# EAGLE board PecanPico7 (EAGLE 7.2.0)
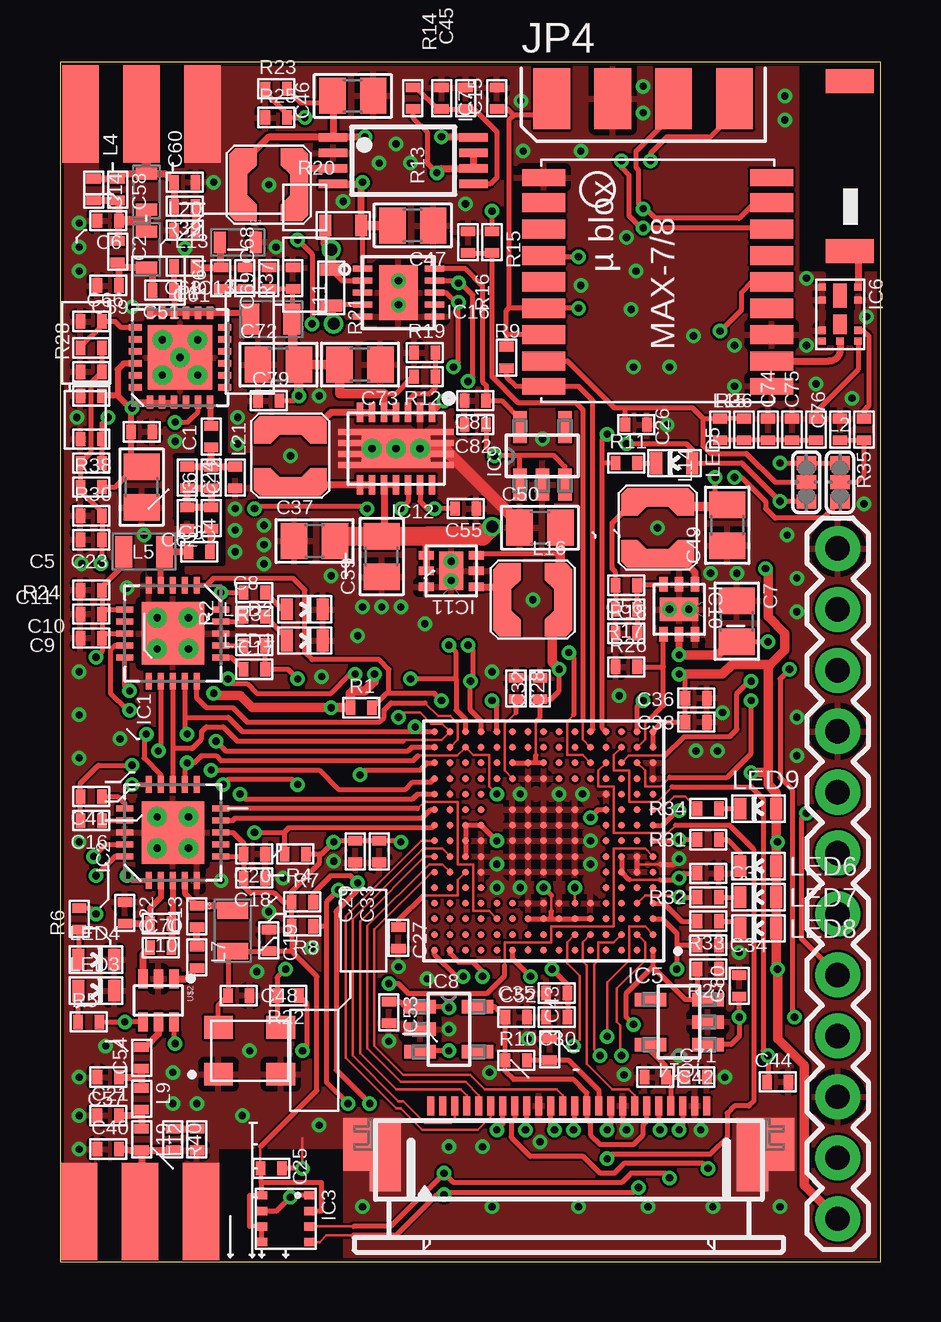
[diagram p5: board, top side]
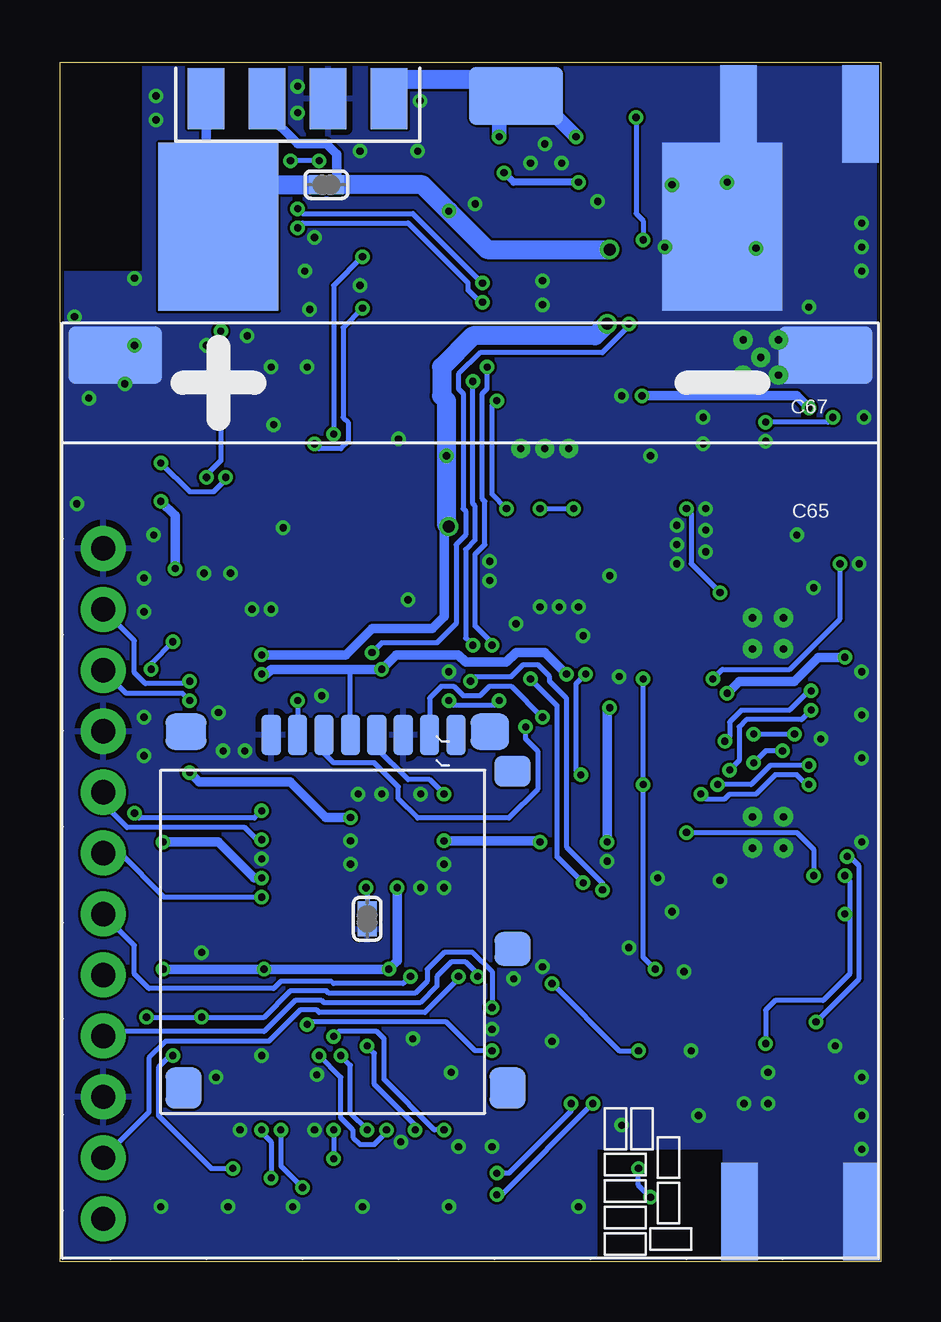
[diagram p6: board, bottom side, seen from below]

Size 34.2 x 50 mm. Coordinates in mm from the lower left corner, seen from the top.
Outline: 0,0 34.2,0 34.2,50 0,50 0,0
Copper layers (1*16): Top 0.035mm / dielectric 1.5mm / Bottom 0.035mm
Design rules "hackvana *": minimum track width 0.1mm, minimum drill 0.3mm, track to track 0.1mm, track to pad 0.1mm, pad to pad 0.1mm, via to via 6mil, smd to smd 0mil, copper to edge 6mil, drill to drill 6mil, minimum pad ring 10mil, minimum via ring 6mil, stop-mask expansion 2mil, vias tented up to drill 100mil, thermal gap 10mil

## Footprints (pad centres in the part's own frame; a part is rotated, then mirrored left to right if it is on the bottom)
LP-443440 = smd 5 x 7: + -10.5,23; - 10.5,23
0402 = smd 0.4 x 0.6: P$1 -0.45,0; P$2 0.45,0
0805 = smd 1.1 x 1.5: 1 -0.85,0; 2 0.85,0
QFN-20 = smd 0.7 x 0.25: 1 -2,1; 2 -2,0.5; 3 -2,0; 4 -2,-0.5; 5 -2,-1; 11 2,-1; 12 2,-0.5; 13 2,0; 14 2,0.5; 15 2,1 | smd 0.25 x 0.7: 6 -1,-2; 7 -0.5,-2; 8 0,-2; 9 0.5,-2; 10 1,-2; 16 1,2; 17 0.5,2; 18 0,2; 19 -0.5,2; 20 -1,2 | smd 2.6 x 2.6: 21 0,0 | drill 0.305: 22 -0.65,0.65; 23 0.65,0.65; 24 0.65,-0.65; 25 -0.65,-0.65
BME280_BME280 = smd 0.5 x 0.35: 1 1.025,0.975; 2 1.025,0.325; 3 1.025,-0.325; 4 1.025,-0.975; 5 -1.025,-0.975; 6 -1.025,-0.325; 7 -1.025,0.325; 8 -1.025,0.975
UBLOX_MAX-6 = smd 1.8 x 0.7: 1_GND 4.95,-4.4; 9_V_RESET 4.95,4.3; 10_GND -4.55,4.3; 18_RESERVED -4.55,-4.4 | smd 1.8 x 0.8: 2_TXD1 4.95,-3.35; 3_RXD1 4.95,-2.25; 4_TIMEPULSE 4.95,-1.15; 5_EXTINT0 4.95,-0.05; 6_V_BCKP 4.95,1.05; 7_VCC_IO 4.95,2.15; 8_VCC 4.95,3.25; 11_RF_IN -4.55,3.25; 12_GND -4.55,2.15; 13_ANTON -4.55,1.05; 14_VCC_RF -4.55,-0.05; 15_RESERVED -4.55,-1.15; 16_SDA2 -4.55,-2.25; 17_SCL2 -4.55,-3.35
UFBGA176 = smd 0.3 x 0.3: A1 -4.55,4.55; A2 -3.9,4.55; A3 -3.25,4.55; A4 -2.6,4.55; A5 -1.95,4.55; A6 -1.3,4.55; A7 -0.65,4.55; A8 0,4.55; A9 0.65,4.55; A10 1.3,4.55; A11 1.95,4.55; A12 2.6,4.55; A13 3.25,4.55; A14 3.9,4.55; A15 4.55,4.55; B1 -4.55,3.9; B2 -3.9,3.9; B3 -3.25,3.9; B4 -2.6,3.9; B5 -1.95,3.9; B6 -1.3,3.9; B7 -0.65,3.9; B8 0,3.9; B9 0.65,3.9; B10 1.3,3.9; B11 1.95,3.9; B12 2.6,3.9; B13 3.25,3.9; B14 3.9,3.9; B15 4.55,3.9; C1 -4.55,3.25; C2 -3.9,3.25; C3 -3.25,3.25; C4 -2.6,3.25; C5 -1.95,3.25; C6 -1.3,3.25; C7 -0.65,3.25; C8 0,3.25; C9 0.65,3.25; C10 1.3,3.25; C11 1.95,3.25; C12 2.6,3.25; C13 3.25,3.25; C14 3.9,3.25; C15 4.55,3.25; D1 -4.55,2.6; D2 -3.9,2.6; D3 -3.25,2.6; D4 -2.6,2.6; D5 -1.95,2.6; D6 -1.3,2.6; D7 -0.65,2.6; D8 0,2.6; D9 0.65,2.6; D10 1.3,2.6; D11 1.95,2.6; D12 2.6,2.6; D13 3.25,2.6; D14 3.9,2.6; D15 4.55,2.6; E1 -4.55,1.95; E2 -3.9,1.95; E3 -3.25,1.95; E4 -2.6,1.95; E12 2.6,1.95; E13 3.25,1.95; E14 3.9,1.95; E15 4.55,1.95; F1 -4.55,1.3; F2 -3.9,1.3; F3 -3.25,1.3; F4 -2.6,1.3; F6 -1.3,1.3; F7 -0.65,1.3; F8 0,1.3; F9 0.65,1.3; F10 1.3,1.3; F12 2.6,1.3; F13 3.25,1.3; F14 3.9,1.3; F15 4.55,1.3; G1 -4.55,0.65; G2 -3.9,0.65; G3 -3.25,0.65; G4 -2.6,0.65; G6 -1.3,0.65; G7 -0.65,0.65; G8 0,0.65; G9 0.65,0.65; G10 1.3,0.65; G12 2.6,0.65; G13 3.25,0.65; G14 3.9,0.65; G15 4.55,0.65; H1 -4.55,0; H2 -3.9,0; H3 -3.25,0; H4 -2.6,0; H6 -1.3,0; H7 -0.65,0; H8 0,0; H9 0.65,0; H10 1.3,0; H12 2.6,0; H13 3.25,0; H14 3.9,0; H15 4.55,0; J1 -4.55,-0.65; J2 -3.9,-0.65; J3 -3.25,-0.65; J4 -2.6,-0.65; J6 -1.3,-0.65; J7 -0.65,-0.65; J8 0,-0.65; J9 0.65,-0.65; J10 1.3,-0.65; J12 2.6,-0.65; J13 3.25,-0.65; J14 3.9,-0.65; J15 4.55,-0.65; K1 -4.55,-1.3; K2 -3.9,-1.3; K3 -3.25,-1.3; K4 -2.6,-1.3; K6 -1.3,-1.3; K7 -0.65,-1.3; K8 0,-1.3; K9 0.65,-1.3; K10 1.3,-1.3; K12 2.6,-1.3; K13 3.25,-1.3; K14 3.9,-1.3; K15 4.55,-1.3; L1 -4.55,-1.95; L2 -3.9,-1.95; L3 -3.25,-1.95; L4 -2.6,-1.95; L12 2.6,-1.95; L13 3.25,-1.95; L14 3.9,-1.95; L15 4.55,-1.95; M1 -4.55,-2.6; M2 -3.9,-2.6; M3 -3.25,-2.6; M4 -2.6,-2.6; M5 -1.95,-2.6; M6 -1.3,-2.6; M7 -0.65,-2.6; M8 0,-2.6; M9 0.65,-2.6; M10 1.3,-2.6; M11 1.95,-2.6; M12 2.6,-2.6; M13 3.25,-2.6; M14 3.9,-2.6; M15 4.55,-2.6; N1 -4.55,-3.25; N2 -3.9,-3.25; N3 -3.25,-3.25; N4 -2.6,-3.25; N5 -1.95,-3.25; N6 -1.3,-3.25; N7 -0.65,-3.25; N8 0,-3.25; N9 0.65,-3.25; N10 1.3,-3.25; N11 1.95,-3.25; N12 2.6,-3.25; N13 3.25,-3.25; N14 3.9,-3.25; N15 4.55,-3.25; P1 -4.55,-3.9; P2 -3.9,-3.9; P3 -3.25,-3.9; P4 -2.6,-3.9; P5 -1.95,-3.9; P6 -1.3,-3.9; P7 -0.65,-3.9; P8 0,-3.9; P9 0.65,-3.9; P10 1.3,-3.9; P11 1.95,-3.9; P12 2.6,-3.9; P13 3.25,-3.9; P14 3.9,-3.9; P15 4.55,-3.9; R1 -4.55,-4.55; R2 -3.9,-4.55; R3 -3.25,-4.55; R4 -2.6,-4.55; R5 -1.95,-4.55; R6 -1.3,-4.55; R7 -0.65,-4.55; R8 0,-4.55; R9 0.65,-4.55; R10 1.3,-4.55; R11 1.95,-4.55; R12 2.6,-4.55; R13 3.25,-4.55; R14 3.9,-4.55; R15 4.55,-4.55
ALM-GP003 = smd 0.3 x 0.3: 1 -1.125,0.75; 2 -1.125,-0.75; 3 -0.595,-0.75; 4 0.675,-0.75; 5 1.125,-0.75; 6 1.125,0; 7 1.125,0.75; 8 0.675,0.75; 9 -0.595,0.75 | smd 1 x 0.55: P1 -0.775,0 | smd 0.8 x 0.55: P2 0.425,0
TSSOP8 = smd 1.2 x 0.35: 1 -2.925,0.975; 2 -2.925,0.325; 3 -2.925,-0.325; 4 -2.925,-0.975; 5 2.925,-0.975; 6 2.925,-0.325; 7 2.925,0.325; 8 2.925,0.975
SOT95P290X145-5N = smd 1.321 x 0.559: 1 -1.194,0.94; 2 -1.194,0; 3 -1.194,-0.94; 4 1.194,-0.94; 5 1.194,0.94
SON65P210X210X80-7N = smd 0.61 x 0.356: 1 -1.041,0.66; 2 -1.041,0; 3 -1.041,-0.66; 4 1.041,-0.66; 5 1.041,0; 6 1.041,0.66 | smd 0.991 x 1.6: 7 0,0
QFN-14 = smd 0.28 x 0.82: 1 -1.5,-1.51; 2 -1,-1.51; 3 -0.5,-1.51; 4 0,-1.51; 5 0.5,-1.51; 6 1,-1.51; 7 1.5,-1.51; 8 1.5,1.51; 9 1,1.51; 10 0.5,1.51; 11 0,1.51; 12 -0.5,1.51; 13 -1,1.51; 14 -1.5,1.51 | drill 0.3: PGND1 -1,0; PGND2 0,0; PGND3 1,0 | smd 2.85 x 1.63: PGND4 0,0 | smd 0.975 x 0.25: PGND5 -1.913,0.69; PGND6 -1.913,0.23; PGND7 -1.913,-0.23; PGND8 -1.913,-0.69; PGND9 1.913,0.69; PGND10 1.913,0.23; PGND11 1.913,-0.23; PGND12 1.913,-0.69
QFN-24 = smd 0.528 x 0.26: 1 -1.864,1.25; 2 -1.864,0.75; 3 -1.864,0.25; 4 -1.864,-0.25; 5 -1.864,-0.75; 6 -1.864,-1.25; 13 1.864,-1.25; 14 1.864,-0.75; 15 1.864,-0.25; 16 1.864,0.25; 17 1.864,0.75; 18 1.864,1.25 | smd 0.26 x 0.528: 7 -1.25,-1.864; 8 -0.75,-1.864; 9 -0.25,-1.864; 10 0.25,-1.864; 11 0.75,-1.864; 12 1.25,-1.864; 19 1.25,1.864; 20 0.75,1.864; 21 0.25,1.864; 22 -0.25,1.864; 23 -0.75,1.864; 24 -1.25,1.864 | smd 2.7 x 2.7: 25 0,0 | drill 0.3: GND 0,0; P$26 -0.735,0.735; P$27 0.735,0.735; P$28 0.735,-0.735; P$29 -0.735,-0.735
DFN300X300X90-11N = smd 0.8 x 0.25: 1 -1.5,1; 2 -1.5,0.5; 3 -1.5,0; 4 -1.5,-0.5; 5 -1.5,-1; 6 1.5,-1; 7 1.5,-0.5; 8 1.5,0; 9 1.5,0.5; 10 1.5,1 | smd 1.6 x 2.3: 11 0,0
SMA-EDGE = smd 1.524 x 4.064: GND@0 0,0; GND@1 5.08,0; SIG 2.54,0 | smd 1.524 x 4.064 bottom: GND@2 0,0; GND@3 5.08,0
LUXEON-PAD = smd 3.9 x 2.4: P$1 0,0
1X12 = drill 1.016 pad 1.88: 1 0,0; 2 2.54,0; 3 5.08,0; 4 7.62,0; 5 10.16,0; 6 12.7,0; 7 15.24,0; 8 17.78,0; 9 20.32,0; 10 22.86,0; 11 25.4,0; 12 27.94,0
2X4_2 = smd 1.524 x 2.54: 1 -3.81,-0.508; 3 -1.27,-0.508; 5 1.27,-0.508; 7 3.81,-0.508 | smd 1.524 x 2.54 bottom: 2 -3.81,-0.508; 4 -1.27,-0.508; 6 1.27,-0.508; 8 3.81,-0.508
0603@1 = smd 0.5 x 0.9: P$1 -0.75,0; P$2 0.75,0
0805@1 = smd 0.7 x 1.3: P$1 -0.85,0; P$2 0.85,0
LPS3015 = smd 0.762 x 2.54: 1_1 -1.27,0; 2_1 1.27,0 | smd 0.889 x 0.254: 1_2 -0.953,-1.397; 1_3 -0.953,1.397; 2_2 0.953,-1.397; 2_3 0.953,1.397 | smd 0.381 x 0.445: 1_4 -0.699,-1.048; 1_5 -0.699,1.048; 2_4 0.699,-1.048; 2_5 0.699,1.048 | smd 0.359 x 0.359 rotated 45: 1_6 -1.398,-1.271; 1_7 -1.398,1.271 | smd 0.538 x 0.538 rotated 45: 1_8 -0.889,-0.823; 1_9 -0.889,0.823 | smd 0.359 x 0.359 rotated 225: 2_6 1.398,-1.271; 2_7 1.398,1.271 | smd 0.538 x 0.538 rotated 225: 2_8 0.889,-0.823; 2_9 0.889,0.823
LED-0603 = smd 0.9 x 0.5: A 0,-0.75; C 0,0.75
0603 = smd 0.5 x 0.9: P$1 -0.75,0; P$2 0.75,0
SJ_2 = smd 0.584 x 0.8: 1 -0.8,0; 2 0,0; 3 0.8,0
SJ = smd 0.584 x 0.8: 1 -0.432,0; 2 0.432,0
MICRO_SD_CONNECTOR = smd 0.8 x 1.7: 1 4.4,15.57; 2 5.5,15.57; 3 6.6,15.57; 4 7.7,15.57; 5 8.8,15.57; 6 9.9,15.57; 7 11,15.57; 8 12.1,15.57 | smd 1.5 x 1.7: P$1 0.75,0.85; P$6 14.25,0.85 | smd 1.7 x 1.5: P$2 0.85,15.7 | smd 1.5 x 1.4: P$3 14.46,6.65 | smd 1.5 x 1.3: P$4 14.46,14.05 | smd 1.6 x 1.5: P$5 13.51,15.7
SC-70 = smd 0.4 x 0.8: 1 -0.65,-0.9; 2 0,-0.9; 3 0.65,-0.9; 4 0.65,0.9; 5 0,0.9; 6 -0.65,0.9
TCXO_3.2X2.5 = smd 1.2 x 0.95: 1 -1.3,-0.975; 2 1.3,-0.975; 3 1.3,0.975; 4 -1.3,0.975
JTI_ANTENNA-1575AT43A40 = smd 1 x 2: FEED -3.175,0; NC 3.925,0
52745-2490 = smd 0.3 x 0.8: 1 -5.75,2.5; 2 -5.25,2.5; 3 -4.75,2.5; 4 -4.25,2.5; 5 -3.75,2.5; 6 -3.25,2.5; 7 -2.75,2.5; 8 -2.25,2.5; 9 -1.75,2.5; 10 -1.25,2.5; 11 -0.75,2.5; 12 -0.25,2.5; 13 0.25,2.5; 14 0.75,2.5; 15 1.25,2.5; 16 1.75,2.5; 17 2.25,2.5; 18 2.75,2.5; 19 3.25,2.5; 20 3.75,2.5; 21 4.25,2.5; 22 4.75,2.5; 23 5.25,2.5; 24 5.75,2.5 | smd 2.4 x 2.2: P$1 -8.2,0.9; P$2 8.2,0.9 | smd 1.3 x 0.85: P$3 7.65,-0.625; P$4 -7.65,-0.625

## Placement (x,y rotation side)
BATT  LP-443440  [LP-443440]  17.1,20.15 0 bottom
C1  470pF  [0402]  6.3,34.4 90 top
C2  2.2pF  [0402]  2.4,42.1 270 top
C3  470pF  [0402]  5.8,29.6 180 top
C4  47pF  [0402]  5.3,31 90 top
C5  2.2uF  [0402]  1.3,34.3 0 top
C6  47pF  [0402]  2,43.4 0 top
C7  10uF  [0805]  28.2,26.7 270 top
C8  100pF  [0402]  8.1,25.7 0 top
C9  100pF  [0402]  1.3,26 0 top
C10  100nF  [0402]  1.3,27 0 top
C11  2.2uF  [0402]  1.3,28 0 top
C12  47pF  [0402]  7.3,32.7 90 top
C13  470pF  [0402]  5.7,14.4 90 top
C14  2.7pF  [0402]  1.4,44.7 270 top
C15  100nF  [0402]  18.2,48.5 90 top
C16  100pF  [0402]  1.3,18.4 180 top
C17  100pF  [0402]  8.1,24.7 0 top
C18  100pF  [0402]  8.1,16 180 top
C19  100nF  [0402]  8.7,13.4 270 top
C20  2.2uF  [0402]  8.1,17 180 top
C21  18pF  [0402]  2,6.1 0 top
C22  470pF  [0402]  2.7,14.55 270 top
C23  1uF  [0402]  1.3,30.1 0 top
C24  10pF  [0402]  5.3,32.7 270 top
C25  100nF  [0402]  8.8,3.9 180 top
C26  100nF  [0402]  24,34.9 180 top
C27  2.2uF  [0402]  14.1,13.5 270 top
C28  2.2uF  [0402]  19,23.9 90 top
C29  2.2uF  [0402]  12.3,17.1 270 top
C30  2.2uF  [0402]  20.7,10.2 180 top
C31  100nF  [0402]  27,16.2 0 top
C32  100nF  [0402]  20,23.9 90 top
C33  100nF  [0402]  13.3,17.1 270 top
C34  100nF  [0402]  27,13.2 0 top
C35  100nF  [0402]  20.7,11.2 180 top
C36  2.2uF  [0402]  26.5,23.5 0 top
C37  22uF  [0805]  10.6,30.05 0 top
C38  100nF  [0402]  26.5,22.5 0 top
C39  10uF  [0805]  13.4,29.4 90 top
C40  12pF  [0402]  2,4.7 0 top
C41  100pF  [0402]  1.3,19.4 180 top
C42  100pF  [0402]  24.8,7.7 180 top
C43  100nF  [0402]  20.4,8.85 90 top
C44  15pF  [0402]  29.9,7.5 0 top
C45  1nF  [0402]  16.9,48.5 270 top
C46  22uF  [0805]  12.2,48.6 180 top
C47  10uF  [0805]  14.7,43.2 180 top
C48  100nF  [0402]  7.45,11.1 0 top
C49  10uF  [0805]  27.8,30.7 90 top
C50  10uF  [0805]  20,30.6 0 top
C51  470pF  [0402]  4.3,40.5 180 top
C52  100nF  [0402]  19,10.2 0 top
C53  100nF  [0402]  13.7,10.4 270 top
C54  470pF  [0402]  3.4,8.5 90 top
C55  100nF  [0402]  16.9,31.4 180 top
C56  22pF  [0402]  23.6,28.2 180 top
C57  12pF  [0402]  2,7.7 180 top
C58  3.3pF  [0402]  2.4,44.7 270 top
C59  33pF  [0402]  2,40.7 0 top
C60  30pF  [0402]  5.2,45 180 top
C61  220pF  [0402]  3.4,34.6 180 top
C62  10uF  [0805]  3.4,32.3 90 top
C63  8.2pF  [0402]  5.2,41.5 180 top
C64  8.2pF  [0402]  6.7,41 90 top
C65  1uF  [0402]  1.3,36.1 0 top
C66  2.2uF  [0402]  1.3,39.2 0 top
C67  1uF  [0402]  1.3,37.1 0 top
C68  1nF  [0402]  9.7,41 270 top
C69  2.2uF  [0402]  8.7,41 270 top
C70  470pF  [0402]  4.2,13.1 0 top
C71  100nF  [0402]  26.5,7.7 0 top
C72  22uF  [0805]  9.1,37.4 0 top
C73  22uF  [0805]  12.5,37.4 180 top
C74  100nF  [0402]  29.5,34.7 270 top
C75  47pF  [0402]  30.5,34.7 270 top
C76  330pF  [0402]  32.5,34.7 270 top
C79  100nF  [0402]  8.7,35.9 0 top
C80  100nF  [0402]  28.3,11.5 90 top
C81  100nF  [0402]  17.3,35.9 180 top
C82  100nF  [0402]  17.3,34.9 180 top
IC1  Si4060-B1B-FM  [QFN-20]  4.7,26.2 270 top
IC2  Si4060-B1B-FM  [QFN-20]  4.7,17.9 90 top
IC3  BME280_BME280  [BME280_BME280]  9.4,1.8 0 top
IC4  uBlox MAX7/8  [UBLOX_MAX-6]  25.1,40.8 180 top
IC5  STM32F429IIH6  [UFBGA176]  20.15,17.55 180 top
IC6  ALM-GP003  [ALM-GP003]  32.5,39.5 270 top
IC7  SPV1040  [TSSOP8]  14.3,45.9 0 top
IC8  TI TC1185-1.8VCT713  [SOT95P290X145-5N]  16.2,9.7 0 top
IC9  TPS78227DDCR  [SOT95P290X145-5N]  20.1,33.6 90 top
IC10  TPS62260DRVT  [SON65P210X210X80-7N]  25.8,27.2 270 top
IC11  TPS62261DRVT  [SON65P210X210X80-7N]  16.3,28.8 180 top
IC12  TPS63021  [QFN-14]  14,33.9 180 top
IC13  RF6886  [QFN-24]  5,37.7 90 top
IC14  TPS78227DDCR  [SOT95P290X145-5N]  25.8,10 180 top
IC16  PAC1720-1-AIA-TR  [DFN300X300X90-11N]  14.1,40.4 0 top
J$1  SMA_EDGE  [SMA-EDGE]  0.85,47.85 0 top
J$2  SMA_EDGE  [SMA-EDGE]  0.8,2.1 0 top
JP2  [LUXEON-PAD]  15.2,48.6 180 bottom
JP3  [1X12]  32.4,1.8 90 top
JP4  [2X4_2]  24.3,49 0 top
JP5  [LUXEON-PAD]  2.3,37.8 0 bottom
JP6  [LUXEON-PAD]  31.9,37.8 180 bottom
L1  59nH  [0603@1]  3.6,42.2 90 top
L2  1.8nH  [0402]  31.5,34.7 270 top
L3  56nH  [0402]  6.3,31 90 top
L4  51nH  [0603@1]  3.6,44.6 90 top
L5  470nH  [0805@1]  3.5,29.6 180 top
L6  30nH  [0402]  6.3,32.7 90 top
L7  56nH  [0402]  5.7,12.7 270 top
L8  470nH  [0805@1]  7.2,13.8 270 top
L9  22nH  [0402]  3.4,6.8 270 top
L10  56nH  [0402]  4.2,14.1 180 top
L11  470nH  [0805@1]  8.8,39.3 0 top
L12  2.2uH  [0402]  5.7,5.1 90 top
L13  LPS3015-103MRB  [LPS3015]  8.7,44.9 0 top
L14  LPS3015-222MRB  [LPS3015]  24.9,30.6 270 top
L15  22nH  [0402]  27.5,34.7 90 top
L16  LPS3015-222MRB  [LPS3015]  19.7,27.6 180 top
L17  30nH  [0603@1]  7.4,42.5 180 top
L19  22nH  [0402]  3.4,5.1 270 top
L20  2.2uH  [0402]  5.2,43 0 top
L21  LPS3015-222MRB  [LPS3015]  9.6,33.6 270 top
LED1  blue  [LED-0603]  10.2,25.9 270 top
LED2  blue  [LED-0603]  10.2,27.2 270 top
LED3  yellow  [LED-0603]  1.5,11.3 270 top
LED4  blue  [LED-0603]  1.5,12.6 270 top
LED5  red  [LED-0603]  25.6,33.3 90 top
LED6  red  [LED-0603]  29.1,16.5 90 top
LED7  yellow  [LED-0603]  29.1,15.2 90 top
LED8  green  [LED-0603]  29.1,13.9 90 top
LED9  green  [LED-0603]  29.1,18.9 90 top
R1  110k  [0402]  12.55,23.1 0 top
R2  1k  [0402]  8.1,26.9 180 top
R3  330R  [0402]  8.1,27.9 180 top
R4  110k  [0402]  9.8,17 180 top
R5  1k  [0402]  1.2,10 0 top
R6  330R  [0402]  0.8,14.3 90 top
R7  10k  [0402]  10.1,15 180 top
R8  10k  [0402]  10.1,14 180 top
R9  100k  [0402]  18.6,37.7 270 top
R10  DIODE  [0402]  19,8.4 0 top
R11  1k  [0402]  23.6,33.3 0 top
R12  0R  [0402]  15.2,36.9 180 top
R13  22k  [0402]  14.7,48.5 270 top
R14  10k  [0402]  15.9,48.5 270 top
R15  22k  [0402]  18,42.5 90 top
R16  10k  [0402]  17,42.5 270 top
R17  511k  [0402]  23.6,27.2 180 top
R18  110k  [0402]  23.6,26.2 0 top
R19  [0402]  15.2,37.9 0 top
R20  0.1R  [0603]  11.8,43.2 180 top
R21  0.1R  [0603]  11.3,40.6 270 top
R22  10k  [0402]  9.5,11.1 180 top
R23  1k  [0402]  9,48.9 0 top
R24  220R  [0402]  1.3,33.3 0 top
R25  1k  [0402]  9,47.7 0 top
R26  10k  [0402]  23.6,24.8 0 top
R27  110k  [0402]  27,12.2 180 top
R28  220R  [0402]  1.3,38.1 0 top
R30  10k  [0402]  1.3,31.1 0 top
R31  1k  [0402]  27,17.6 180 top
R32  1k  [0402]  27,15.2 180 top
R33  1k  [0402]  27,14.2 180 top
R34  1k  [0402]  27,18.9 180 top
R35  4.7k  [0402]  33.5,34.7 270 top
R36  10k  [0402]  28.5,34.7 90 top
R37  51R  [0402]  7.7,41 270 top
R38  1k  [0402]  1.3,32.3 0 top
R39  22k  [0402]  5.2,44 180 top
R40  22k  [0402]  4.7,5.1 270 top
SJ1  [SJ_2]  32.5,32.5 270 top
SJ2  [SJ_2]  31.1,32.5 270 top
SJ3  [SJ]  23.1,44.9 0 bottom
SJ7  [SJ]  21.4,14.3 270 bottom
U$1  MICROSD_SPI_MODE  [MICRO_SD_CONNECTOR]  29.8,6.4 0 bottom
U$2  AS213-92LF  [SC-70]  4.1,10.9 180 top
U$3  TXC_7Z7Q  [TCXO_3.2X2.5]  7.9,8.8 0 top
U$4  JTI_ANTENNA-1575AT43A40  [JTI_ANTENNA-1575AT43A40]  32.9,45.3 90 top
X1  52745-2490  [52745-2490]  21.2,4 0 top

## Tracks (layer width: path | path; a pad name or v marks a point on that pad's centre or on a via)
BATTERY
  Bottom 0.2: 23.7,44.9 SJ3.1
  Bottom 0.4: 27.6,44.9 27.6,44 | 27.6,44 BATT.+ | JP4.8 28.11,44 27.6,44
  Bottom 0.8: 27.6,44.9 23.7,44.9
BOOT0  (via drill 0.3)
  Top 0.1: IC5.D6 v21.45,15.6
  Bottom 0.2: SJ7.1 21.4,15.55 v21.45,15.6
CAM_D2
  Top 0.1: X1.6 17.95,6.05 17.4,5.5 15.1,5.5 14.2,6.4 14,6.4 11.9,8.5 11.9,14.4 15.05,17.55 IC5.H15
CAM_D3
  Top 0.1: X1.4 16.95,6.95 16.7,7.2 14,7.2 12.5,8.7 12.5,14.2 15.2,16.9 IC5.G15
CAM_D4
  Top 0.1: IC5.G14 15.93,17.23 15.12,17.23 12.2,14.3 12.2,8.6 14.1,6.7 14.3,6.7 15.2,5.8 16.3,5.8 16.45,5.95 X1.3
CAM_D5
  Top 0.1: IC5.F14 15.93,16.57 15.38,16.57 12.8,14 12.8,8.9 14.2,7.5 16.9,7.5 17.45,6.95 X1.5
CAM_D6  (via drill 0.3)
  Top 0.1: IC5.B1 24.38,13.97 23.73,13.97 23.73,12.57 22.8,11.65 v22.8,9.4
  Top 0.2: v18.2,5.5 18.45,5.75 X1.7
  Bottom 0.2: v18.2,5.5 18.6,5.5 20.7,7.6 20.7,9.3 21,9.6 22.6,9.6 v22.8,9.4
CAM_D7  (via drill 0.3)
  Top 0.1: IC5.B6 21.12,13.32 21.12,12.45 21.65,11.93 21.65,9.25 v21.4,9
  Top 0.2: X1.9 19.45,5.55 v19.4,5.5
  Bottom 0.2: v19.4,5.5 19.4,5.7 21.1,7.4 21.1,8.7 v21.4,9
CAM_D8  (via drill 0.3)
  Top 0.1: IC5.B2 24.38,13.32 24.38,12.57 23.2,11.4 23.2,10 23.35,9.85 23.35,8.65 v23.4,8.6
  Top 0.2: v20.6,5.5 20.45,5.65 X1.11
  Bottom 0.2: v20.6,5.5 20.6,5.4 21.1,4.9 21.7,4.9 22,5.2 22,5.5 22.5,6 22.5,7.7 v23.4,8.6
CAM_D9  (via drill 0.3)
  Top 0.1: IC5.B3 23.07,13.32 22.43,13.32 22.43,12.57 22.25,12.4 22.25,8.85 v22.5,8.6
  Top 0.2: v21.4,5.5 21.45,5.55 X1.13
  Bottom 0.2: v21.4,5.5 22.1,6.2 22.1,8.2 v22.5,8.6
CAM_EN  (via drill 0.3)
  Top 0.2: IC5.A1 24.7,12.3 | 24.7,12.3 26.06,10.94 IC14.3 26.55,10.94 R27.P$2 | 24.7,12.3 23.6,11.2 23.6,10.2 v23.9,9.9 | v16.2,8.8 15.01,8.8 IC8.3
  Bottom 0.2: v23.9,9.9 23.8,10 18.1,10 16.9,8.8 v16.2,8.8
CAM_HREF  (via drill 0.3)
  Top 0.1: IC5.N4 22.43,20.48 22.43,19.82 23.07,19.82 23.07,17.88 25.32,17.88 25.65,18.2
  Top 0.2: X1.16 22.95,5.65 v22.8,5.5 | 25.65,18.2 27.9,18.2 28.9,17.2 28.9,6.7 28.7,6.5 28.1,6.5 27.8,6.2 27.8,5.2 27.1,4.5 23,4.5 v22.8,4.3
  Bottom 0.2: v22.8,5.5 v22.8,4.3
CAM_PCLK  (via drill 0.3)
  Top 0.1: IC5.P3 23.07,21.12 23.07,20.48 23.73,20.48 23.73,19.18 24.88,19.18 25.5,19.8
  Top 0.2: X1.8 18.95,5.95 18.8,5.8 18.8,5.2 19.6,4.4 21.8,4.4 22.5,3.7 23.1,3.7 23.5,4.1 26.8,4.1 v27,3.9 | C44.P$1 29.5,7.5 v29.5,8.6 29.3,8.8 29.3,19.3 28.8,19.8 25.5,19.8
  Bottom 0.2: v29.5,8.6 29.6,8.6 30.1,8.1 30.1,6.1 27.9,3.9 v27,3.9
CAM_VCC
  Top 0.2: IC8.5 18.11,10.64 C52.P$1 R10.P$1 18.55,7.95 18.9,7.6 21.4,7.6 21.95,7.05 X1.14 21.95,5.95 22.1,5.8 22.1,5.3 22.5,4.9 23.9,4.9 24.3,5.3 24.3,5.7 24.45,5.85 X1.19
CAM_VCC_ANALOG
  Top 0.2: 25.45,7.7 C71.P$1 | 25.45,7.7 C42.P$1 25.25,8.15 24.61,8.79 IC14.5 | 25.45,7.7 X1.21
CAM_VSYNC
  Top 0.1: IC5.B5 21.77,13.32 21.77,12.53 21.95,12.35 21.95,8.25 23,7.2 23.7,7.2 23.95,6.95 X1.18
CAM_XCLK
  Top 0.1: X1.12 20.95,6.95 20.7,7.2 17.7,7.2 17.1,7.8 14.3,7.8 13.1,9 13.1,13.85 15.5,16.25 IC5.F15
CLOCK  (via drill 0.3)
  Top 0.2: v9.4,12.2 9.05,11.85 R22.P$2 9.05,9.78 U$3.3 | v6.8,19.9 7,20.1 9.7,20.1 v9.9,19.9 | C16.P$2 C41.P$2 0.85,19.95 1.6,20.7 v3,20.7 | v9.9,24.3 9.5,24.7 C17.P$2 C8.P$2
  Bottom 0.2: v9.4,12.2 9.9,12.7 v9.9,19.9 v9.9,24.3 | v3,20.7 4.6,20.7 5.4,19.9 v6.8,19.9
GND  (via drill 0.3)
  Top 0.1: 24.05,16.57 25,16.57 | v10.1,3.9 10.1,5.15
  Top 0.2: IC5.F2 24.05,16.57 IC5.G2 | X1.17 23.45,5.65 v23.6,5.5 | IC1.25 IC1.21 | IC3.7 9.03,2.12 v9.6,2.7 9.68,2.77 IC3.1 | v10.1,3.9 C25.P$1 | 25,16.57 25.57,16.57 v25.8,16.8
  Top 0.5: C50.1 19.15,30.75 16,33.9 IC12.PGND1
  Bottom 0.2: v9.6,2.7 10.1,3.2 v10.1,3.9
  other vias: 22.1,17.55 18.2,16.57 18.2,15.6 19.18,15.6 17.6,4.8 33.6,39.4 0.8,42.3 23.8,39.7 21.7,40.7 23.9,37.3 25.4,37.3 26.4,38.6 30.2,48.6 30.7,28.5 30.7,21.1 21.6,2.3 30.3,30.3 33,36 31.1,38.2 31.1,41 20.8,19.5 22.1,16.57 18,2.3 24.5,2.3 27.2,2.3 14.1,39.9 14.1,40.9 28.1,38.2 28.1,36.5 30.7,22.7 28.3,12.9 23.6,42.7 24,41.3 14.6,45.8 19.2,48.4 13.3,45.8 19.3,46.3 30.2,47.6 31.5,36.6 25.4,27.2 30.7,27.1 19.18,19.5 23.5,7.8 4.8,34.2 0.8,21 0.8,22.8 6.7,15.9 18,24.6 16.2,9.7 9.3,16 0.9,29.1 11.4,16.7 26.2,27.2 2.8,28.1 27.6,22.9 0.7,35.2 0.8,17.5 26.5,21.3 23.3,23.6 27.1,28.7 28.2,28.7 20,5 21.77,19.5 4.7,7.9 4.7,6.6 0.8,4.7 0.8,6.1 0.8,7.7 1.9,9 12.6,2.3 16.2,4.8 30,2.3 33.5,31.6 9,42.3 0.8,41.3 0.8,43.3 6.4,45 11.8,44.2 8.7,14.6 11.3,28.6 16.9,44.1 21.7,46.3 8.5,30.7 8.5,29.1 8.5,29.9 7.3,30.5 7.3,31.4 7.4,35.2 7.4,34.1 9.6,33.6 10.8,36.1 5.2,42.25 8.7,44.9 25.3,34.9 14,46.6 3.5,30.3 20.1,34.3 16.3,28.4 16.3,29.2 27.7,7.7 25.8,8.6 26.7,5.5 13.7,9.2 10.5,13.1 7.9,8.8 19.7,27.6 24.9,30.6 15.2,26.6 12.6,27.3 13.4,27.3 12.4,26.1 8.2,12.1 5.7,6.6 7.6,6.1 10.8,5.7 14.2,27.3 7.3,29.6 10.9,24.4 0.8,24.6 2.5,21.8 14.1,12.3 19.5,9.3 15.3,11.8 17.9,7.9 3,39.8 27.4,21.3 24.3,49 24.3,47.9
  pour Bottom: 0,50 30.7,50 30.7,41.2 34.2,41.2 34.2,0 11.9,0 11.9,4.8 6.5,4.8 6.5,0 0,0
  pour Top: 0,50 1.5,50 1.5,45.5 5.3,45.5 5.3,50 30.7,50 30.7,41.2 31.8,41.2 31.8,38.1 33.2,38.1 33.2,41.2 34.2,41.2 34.2,0 11.9,0 11.9,4.8 6.5,4.8 6.5,0 5.3,0 5.3,4.3 1.4,4.3 1.4,0 0,0
  cutout Top: 4.8,33.6 4.8,31 5.6,31 5.6,30.3 3.7,30.3 3.7,28.7 5.1,28.7 5.1,29.1 6.8,29.1 6.8,32.8 7.9,32.8 7.9,33.6 6.9,33.6 6.9,36 5.7,36 5.7,33.6
GPS_BIAS
  Top 0.2: C76.P$2 R35.P$2 33.5,32.8 33.2,32.5 SJ1.2
GPS_EN
  Top 0.1: IC5.P2 24.38,21.77 24.38,22.43 24.5,22.55
  Top 0.2: 24.5,22.55 25.14,23.19 25.14,24.8 | R26.P$2 25.14,24.8 | 25.14,24.8 IC10.4
GPS_RESET
  Top 0.2: 20.15,36.25 IC4.9_V_RESET | 20.1,36.55 arc-90 IC4.9_V_RESET | IC5.R5 22.2,22.2 22.2,35.9 21.6,36.5 IC4.9_V_RESET | R9.P$2 18.6,36.9 19,36.5 IC4.9_V_RESET
I2C_SCL  (via drill 0.3)
  Top 0.1: IC3.4 10.82,0.82 11.1,1.1 12.2,1.1
  Top 0.2: IC5.R12 17.55,22.55 17.1,23 v17.1,24.2 17.2,24.3 17.2,25.5 v17,25.7 | IC4.17_SCL2 28.95,44.15 28.3,43.5 24.8,43.5 24.4,43.9 v24.3,43.9 24.1,44.1 24.1,45.52 24,45.62 24,46.3 25.57,47.87 JP4.5 | IC16.9 16.5,40.9 v16.6,40.8 16.7,40.8 17.2,40.3 17.2,36.9 v17,36.7 | v11.6,15.5 11.1,15 11.1,14 | v24.1,3.1 23.9,2.9 16.1,2.9 v16,2.8 15.7,2.8 14,1.1 12.2,1.1 | R8.P$1 11.1,14 | v12,6.6 11.1,7.5 11.1,14 | X1.20 24.95,5.55 v25,5.5
  Bottom 0.2: v24.3,43.9 24.1,43.7 19.5,43.7 v16.6,40.8 | v17.1,24.2 16.9,24.4 15.4,24.4 14.9,24.9 14.3,24.9 13.8,24.4 13.8,24.2 13.1,23.5 13.1,17.3 11.6,15.8 v11.6,15.5 | v16,2.8 15.8,2.8 v12,6.6 | v25,5.5 25,4 v24.1,3.1 | v17,25.7 17.3,26 17.3,29.7 16.9,30.1 16.9,31.5 17,31.6 v17,36.7
I2C_SDA  (via drill 0.3)
  Top 0.1: IC3.3 12.22,1.48
  Top 0.2: IC4.16_SDA2 29.65,43.1 v24.3,43.1 24.2,43.1 23.7,43.6 23.7,45.3 23.4,45.6 v23.4,45.9 | IC5.R13 16.9,22.6 16.5,23 16.5,24.3 | IC16.8 16.1,40.4 16.5,40 v16.6,40 16.6,37.5 v16.4,37.3 | 16.5,24.3 v14.6,24.3 | v25.4,3.5 25.2,3.7 23.8,3.7 23.4,3.3 16.4,3.3 v16,3.7 13.78,1.48 12.22,1.48 | R7.P$1 10.55,15.35 11.3,16.1 12.1,16.1 v12.4,15.8 12.4,15.5 11.5,14.6 11.5,8 v12.9,6.6 | 16.5,24.3 16.5,25.4 v16.2,25.7 | X1.22 25.95,5.65 v25.8,5.5 | v24.6,45.9 24.6,46.2 25.3,46.9 27.1,46.9 28.11,47.91 JP4.7
  Bottom 0.2: v24.3,43.1 24.1,43.3 19.7,43.3 17.2,40.8 17.2,40.5 16.7,40 v16.6,40 | v14.6,24.3 13.5,23.2 13.5,16.9 v12.4,15.8 | v16.2,25.7 16.2,25.8 16.9,26.5 16.9,29.5 16.5,29.9 16.5,31.7 16.6,31.8 16.6,36.2 16.4,36.4 v16.4,37.3 | v12.9,6.6 12.9,6.3 15.5,3.7 v16,3.7 | v25.8,5.5 25.8,5.4 25.4,5 v25.4,3.5 | v23.4,45.9 v24.6,45.9
LED1  (via drill 0.3)
  Top 0.2: IC5.H1 25.75,17.55 v25.8,17.6 R31.P$2
  Bottom 0.2: v25.8,17.6 26,17.6 26.5,18.1 31.4,18.1 32.4,19.1 JP3.8
LED2  (via drill 0.3)
  Top 0.1: v25.8,15.2 25.73,15.28 24.38,15.28 IC5.D2
  Top 0.2: v25.8,15.2 R32.P$2
  Bottom 0.2: v25.8,15.2 29.86,15.2 31.7,17.04 JP3.7
LED3
  Top 0.2: IC5.D1 25.15,14.95 25.9,14.2 R33.P$2
LED4
  Top 0.1: R34.P$2 26.05,19.4 25.6,19.4 25.05,18.85 IC5.K1
N$1
  Top 0.3: C24.P$2 L6.P$1 L3.P$2 C4.P$2 5.3,32.3
N$2
  Top 0.25: IC1.4 4.2,29.6 L5.P$1
  Top 0.3: L5.P$1 C3.P$2
N$3
  Top 0.3: C3.P$1 6.3,29.65 L3.P$1
N$4
  Top 0.25: IC2.3 4.7,14.1 L10.P$1
  Top 0.3: L10.P$1 C70.P$2
N$5
  Top 0.3: C14.P$2 C58.P$2 2.45,44.25 C6.P$2 2.45,42.55 C2.P$1
  Top 0.4: L1.P$2 L4.P$1 3.6,43.4 C6.P$2
N$6
  Top 0.25: IC13.6 6.25,34.85 C1.P$2
N$7
  Top 0.3: U$4.FEED 33.25,42.12 IC6.1
N$8
  Top 0.3: C2.P$2 2.45,41.65 2.45,41.45 | 2.45,41.45 L1.P$1 3.85,41.45 C51.P$2 | 2.45,41.45 C59.P$2
N$9
  Top 0.2: IC1.16 7.15,25.2 C17.P$1
N$10
  Top 0.3: C24.P$1 L6.P$2 | L6.P$2 C1.P$1 | L6.P$2 C12.P$2
N$11
  Top 0.3: U$2.1 5.25,11.8 L7.P$2
N$12
  Top 0.2: X1.15 22.45,7.15 21.2,8.4 C43.P$1 R10.P$2
N$13
  Top 0.2: IC1.19 7.65,26.7 R2.P$2
N$15
  Top 0.25: IC2.4 5.2,15.35 C13.P$2
  Top 0.3: C13.P$2 7.2,14.85 L8.P$1
N$16
  Top 0.3: L7.P$1 C13.P$1
N$17
  Top 0.3: L17.P$2 6.7,42.5 C64.P$2 5.65,41.45 C63.P$1
N$18
  Top 0.2: C16.P$1 IC2.17
N$19
  Top 0.2: C41.P$1 2.4,19.4 2.7,19.1 IC2.16
N$20
  Top 0.2: R5.P$1 LED3.A
N$21
  Top 0.2: R2.P$1 9.45,26 LED1.A
N$22
  Top 0.2: R3.P$1 9.25,27.2 LED2.A
N$23
  Top 0.2: LED4.A 0.8,12.65 R6.P$1
N$24
  Top 0.3: C64.P$1 R37.P$2
N$25
  Top 0.3: 3.4,6.1 L19.P$1 | C21.P$2 3.4,6.1 | 3.4,6.1 L9.P$2
N$26
  Top 0.3: C70.P$1 3.45,12.8 U$2.3
N$27
  Top 0.2: R11.P$2 LED5.C
N$28
  Top 0.2: R18.P$2 R17.P$1 C56.P$1 24.05,28.24 IC10.3
N$29
  Top 0.3: L19.P$2 3.4,2.1 J$2.SIG | C40.P$2 2.7,4.7 2.95,4.65 L19.P$2 | L19.P$2 R40.P$2
N$30
  Top 0.2: L14.2_7 L14.2_3 L14.2_5 L14.2_9 L14.2_1 L14.2_8 L14.2_4 L14.2_2 L14.2_6
  Top 0.3: IC10.1 26.46,28.74 26,29.2 L14.2_7
N$31
  Top 0.2: L16.2_7 L16.2_3 L16.2_5 L16.2_9 L16.2_1 L16.2_8 L16.2_4 L16.2_2 L16.2_6
  Top 0.3: IC11.1 18.43,28.14 L16.2_1
N$32
  Top 0.2: IC7.5 17.93,44.92 18.2,45.2 18.2,47.1 17.25,48.05 C45.P$2 R14.P$2 15.75,48.05 14.85,48.95 R13.P$1
N$33
  Top 0.3: IC4.11_RF_IN 32.05,37.55 arc90 32.5,38 IC6.6
N$35
  Top 0.1: IC5.F13 16.57,15.93 16.57,15.28 15.15,15.28
  Top 0.2: 15.15,15.28 14.1,14.22 C27.P$1
N$36
  Top 0.1: IC5.M10 18.52,20.48 18.52,22.43 19,22.9
  Top 0.2: 19,22.9 C28.P$1
N$37
  Top 0.2: IC1.17 C8.P$1
N$38
  Top 0.2: L13.2_7 L13.2_3 L13.2_5 L13.2_9 L13.2_1 L13.2_8 L13.2_4 L13.2_2 L13.2_6
  Top 0.3: IC7.3 9.59,45.58 L13.2_9
N$39  (via drill 0.3)
  Top 0.1: IC5.G1 24.38,17.23 23.07,17.23 23.07,13.97 20.48,13.97 20.48,13.32 18.52,13.32 18.52,12.35
  Top 0.2: v10.1,8.8 10.3,9 10.3,10.75 R22.P$1 | v13.7,11.6 14.1,11.6 14.5,11.2 17.8,11.2 18.52,11.93 18.52,12.35
  Bottom 0.2: v13.7,11.6 10.9,8.8 v10.1,8.8
N$40
  Top 0.2: R36.P$2 L15.P$2 26.8,35.15 | 26.8,35.15 26.8,34 27.1,33.7 28.6,33.7 29.8,32.5 SJ2.2 | IC4.8_VCC 21.15,37.55 23.1,35.6 23.55,35.6 | 23.55,35.6 26.35,35.6 26.8,35.15 | C26.P$2 23.55,35.6
N$41
  Top 0.3: C14.P$1 C58.P$1 2.6,45.35 L4.P$2 4.4,45.35 C60.P$2 R39.P$2
  Top 0.4: L4.P$2 3.6,47.85 J$1.SIG
N$42
  Top 0.2: R32.P$1 LED7.C
N$43
  Top 0.25: IC13.18 IC13.17 IC13.16 | IC13.16 IC13.15 IC13.14 IC13.13 7.95,39.56 L11.P$1 | IC13.16 C51.P$1 C63.P$2
N$44
  Top 0.2: L21.2_6 L21.2_2 L21.2_4 L21.2_8 L21.2_1 L21.2_9 L21.2_5 L21.2_3 L21.2_7
  Top 0.3: IC12.9 IC12.8 10.87,32.39 L21.2_7
N$45
  Top 0.2: IC6.8 33.48,38.83 33.7,38.6 33.7,35.7 33.5,35.5 R35.P$1
N$46
  Top 0.2: IC6.7 33.25,37.2 31.5,35.45 L2.P$1
N$47
  Top 0.2: R33.P$1 28.35,14.2 LED8.C
N$48
  Top 0.2: R34.P$1 LED9.C
N$49
  Top 0.2: R31.P$1 27.8,17.6 28.35,17.05 LED6.C
N$50
  Top 0.2: L21.1_6 L21.1_2 L21.1_4 L21.1_8 L21.1_1 L21.1_9 L21.1_5 L21.1_3 L21.1_7
  Top 0.3: L21.1_7 11.28,35.41 IC12.7 IC12.6
N$51
  Top 0.2: L2.P$2 C75.P$2 C74.P$2 R36.P$1 L15.P$1
N$54  (via drill 0.3)
  Top 0.2: v27.5,38.8 28.4,39.7 28.4,40.4 28.85,40.85 IC4.14_VCC_RF | SJ1.3 31.8,31 29.8,31 29.4,31.4 29.4,31.7 28.4,32.7 v28.1,32.7
  Bottom 0.2: v28.1,32.7 28.1,32.8 27.5,33.4 v27.5,38.8
N$55
  Top 0.25: IC2.2 4.2,15.2 3.75,14.75 L10.P$2
  Top 0.3: C22.P$2 L10.P$2
N$56
  Top 0.3: L20.P$2 R39.P$1
N$58
  Top 0.3: U$2.5 4.1,9.5 3.55,8.95 C54.P$2
N$59
  Top 0.3: 3.4,7.7 L9.P$1 | C57.P$1 3.4,7.7 | 3.4,7.7 C54.P$1
N$61
  Top 0.3: R40.P$1 L12.P$2
N$62
  Top 0.2: IC12.3 14.5,35.9 14.8,36.2 15.4,36.2 15.65,36.45 R12.P$1 R19.P$2
N$63  (via drill 0.3)
  Top 0.2: IC12.13 15,31.7 15.3,31.4 v15.6,31.4 C55.P$2 | v16,35.9 IC12.1
  Bottom 0.2: v15.6,31.4 16.2,32 16.2,35.7 v16,35.9
NRST  (via drill 0.3)
  Top 0.2: JP3.5 30.9,13.46 30.9,18.5 v31.1,18.7 | IC5.J1 25.1,18.2 25.7,18.8 v25.8,18.8
  Bottom 0.2: v25.8,18.8 26.1,18.5 30.9,18.5 v31.1,18.7
PA_EN  (via drill 0.3)
  Top 0.2: IC12.12 14.5,31.7 v14.2,31.4 | IC1.20 v6.7,27.9 R3.P$2 | v8.1,31.4 8.2,31.5 12.7,31.5 v12.8,31.4
  Bottom 0.2: v14.2,31.4 v12.8,31.4 | v8.1,31.4 7.9,31.2 7.9,29.1 v6.7,27.9
RADIO1_CS
  Top 0.1: IC5.P14 16.57,21.77 16.57,22.43 16.25,22.75 15.75,22.75 15.2,23.3
  Top 0.2: IC1.15 5.7,23.5 6.1,23.1 7.2,23.1 7.8,22.5 13.3,22.5 13.5,22.7 13.5,23 13.8,23.3 15.2,23.3
RADIO1_GPIO0  (via drill 0.3)
  Top 0.2: IC1.9 2.3,25.7 2.1,25.5 2.1,23.7 2.8,23 v2.9,23 | v6.3,20.5 10.8,20.5 11.6,19.7 14.4,19.7 14.7,20 15.45,20 IC5.M15
  Bottom 0.2: v2.9,23 3.3,22.6 5.6,22.6 5.9,22.3 5.9,20.9 v6.3,20.5
RADIO1_GPIO1  (via drill 0.3)
  Top 0.2: v2.9,23.8 2.7,24 IC1.10 | IC5.P15 14.65,21.45 14.5,21.3 6.9,21.3 v6.5,21.7
  Bottom 0.2: v6.5,21.7 6.3,21.9 6.3,22.5 5.8,23 3.8,23 3,23.8 v2.9,23.8
RADIO1_SDN  (via drill 0.3)
  Top 0.2: IC5.R11 18.2,23.2 v18,23.4 | v15.9,23.4 15.6,23.7 13.7,23.7 | IC1.1 6.1,28.2 6.4,28.5 9.7,28.5 10.2,28 10.2,25.4 10.5,25.1 13.3,25.1 13.7,24.7 13.7,23.7 | 13.7,23.7 13.6,23.7 R1.P$2
  Bottom 0.2: v15.9,23.4 16.1,23.2 17.8,23.2 v18,23.4
RADIO1_VREG1
  Top 0.2: R28.P$1 0.85,38.15 1.75,39.05 C66.P$2 2.3,39.2 2.55,38.95 IC13.19
RADIO1_VREG2  (via drill 0.3)
  Top 0.2: R24.P$2 C5.P$2 1.75,34.95 v2,35.2 | v4.8,35 5.3,35 5.75,35.45 IC13.5
  Bottom 0.2: v4.8,35 2.2,35 v2,35.2
RADIO1_VREG_SW  (via drill 0.3)
  Top 0.2: R28.P$2 C67.P$2 1.3,36.65 1.3,33.75 R24.P$1 R38.P$1 0.85,32.15 1.75,31.25 R30.P$2 C23.P$2 1.75,29.15 v1.7,29.1 | v7,24.3 7.2,24.1 7.8,24.1 8.2,23.7 11.3,23.7 12.1,24.5 v12.3,24.5 | v12.5,20.3 12.7,20.5 15,20.5 15.3,20.8 IC5.N15
  Bottom 0.2: v12.5,20.3 12.7,20.5 12.7,24.1 v12.3,24.5 | v1.7,29.1 1.7,26.8 3.8,24.7 6.6,24.7 v7,24.3
RADIO2_CS  (via drill 0.3)
  Top 0.2: v3,19.9 IC2.15 | v7.5,19.5 7.7,19.3 14.7,19.3 14.9,19.5 IC5.L15
  Bottom 0.2: v7.5,19.5 7.3,19.3 6.5,19.3 6.3,19.5 5.2,19.5 4.4,20.3 3.5,20.3 3.1,19.9 v3,19.9
RADIO2_GPIO0
  Top 0.2: IC2.9 7.2,18.4 7.3,18.5 15.1,18.5 15.45,18.85 IC5.K15
RADIO2_GPIO1
  Top 0.1: 14.9,18.9 15.18,19.18 16.57,19.18 16.57,16.57 17.23,16.57 17.23,14.62 17.88,14.62 IC5.C11
  Top 0.2: 14.9,18.9 IC2.10
RADIO2_SDN  (via drill 0.3)
  Top 0.2: v2.8,16.1 3,15.9 IC2.1 | v8.1,17.9 9.35,17.9 | 9.35,17.9 R4.P$2 | 9.35,17.9 9.55,18.1 15.5,18.1 IC5.J15
  Bottom 0.2: v8.1,17.9 3.5,17.9 2.8,17.2 v2.8,16.1
RX_ACTIVE  (via drill 0.3)
  Top 0.2: R5.P$2 v2.7,10 U$2.4 | v1.4,16.9 1.9,17.4 IC2.19
  Bottom 0.2: v2.7,10 0.9,11.8 0.9,16.5 1.3,16.9 v1.4,16.9
SD_CS  (via drill 0.3)
  Top 0.2: IC5.R2 24.05,23.15 v24.3,23.4
  Bottom 0.2: v24.3,23.4 U$1.2
SOLAR_OUT  (via drill 0.3)
  Top 0.2: R20.P$1 12.6,43.2 IC16.1 | R13.P$2 14.7,47.7 15.3,47.1 15.3,45.8 v15.7,45.4
  Top 0.3: IC7.7 IC7.6 15.88,45.58 v15.7,45.4 | IC7.4 12.53,44.92 v12.6,45 12.55,44.95 R20.P$1
  Top 0.4: C47.2 R20.P$1
  Bottom 0.3: v12.6,45 15.3,45 v15.7,45.4
SPI_MISO  (via drill 0.3)
  Top 0.1: v14.1,22.7 14.3,22.9 15,22.9 15.47,22.43 15.93,22.43 IC5.R14 15.9,21.75 14.35,21.75 14.3,21.7
  Top 0.2: IC1.13 4.7,21.4 | 4.7,21.4 5.5,21.4 5.9,21.8 5.9,22.1 6.1,22.3 6.8,22.3 7.4,21.7 14.3,21.7 | 4.7,21.4 IC2.13
  Bottom 0.2: U$1.7 18.8,23.5 18.3,24 17.8,24 17.4,23.6 16.7,23.6 16.3,24 15.4,24 v14.1,22.7
SPI_MOSI  (via drill 0.3)
  Top 0.2: 14.8,22.1 IC5.R15 | v3.6,22 3.5,21.9 3.5,21 4.2,20.3 IC2.14 | 14.8,22.1 7.6,22.1 7,22.7 5.2,22.7 | 14.8,22.1 v14.8,22.3 | IC1.14 5.2,22.7 | 5.2,22.7 5.2,22.1 v5.3,22
  Bottom 0.2: U$1.3 23.2,21.2 22.8,20.8 21.1,20.8 20.1,19.8 20.1,19.3 19.3,18.5 15.5,18.5 14.3,19.7 14.3,21.3 14.8,21.8 v14.8,22.3 | v5.3,22 v3.6,22
SPI_SCK  (via drill 0.3)
  Top 0.1: v18.2,19.5 17.88,19.82 17.88,21.12 17.23,21.12 IC5.P13 16.55,21.1 14.93,21.1
  Top 0.2: IC2.12 5.2,20.7 v5.3,20.8 5.6,20.8 5.9,21.1 6.5,21.1 6.7,20.9 14.72,20.9 14.93,21.1 | IC1.12 4.2,21.4 v4.1,21.3
  Bottom 0.2: U$1.5 21,21.4 19.7,20.1 18.8,20.1 v18.2,19.5 | v4.1,21.3 4.8,21.3 v5.3,20.8
SWCLK  (via drill 0.3)
  Top 0.2: IC5.A14 16.25,12.85 16.6,12.5 17.2,12.5 17.6,12.1 v17.6,11.9
  Bottom 0.2: JP3.2 30.5,6.24 30.5,8.5 29.8,9.2 25.5,9.2 24.2,10.5 23.5,10.5 23.4,10.4 19,10.4 17.6,11.8 v17.6,11.9
SWDIO  (via drill 0.3)
  Top 0.2: v16.8,11.9 16.5,11.9 15.6,12.8 IC5.A15
  Bottom 0.2: v16.8,11.9 16.8,12 17.3,12.5 17.9,12.5 18.5,11.9 18.5,11.5 19.2,10.8 23.2,10.8 23.3,10.9 24.4,10.9 25.7,9.6 32.22,9.6 JP3.4
SWO  (via drill 0.3)
  Top 0.2: IC5.A10 18.85,12.65 v19.6,11.9
  Bottom 0.2: JP3.6 31.1,13.2 31.1,12 30.5,11.4 25.3,11.4 25,11.7 22.9,11.7 22.8,11.6 19.9,11.6 v19.6,11.9
TIMEPULSE  (via drill 0.3)
  Top 0.2: IC4.4_TIMEPULSE 20.1,41.9 v21.6,41.9 | 22.6,33.3 22.6,22.25 IC5.R4 | 22.6,33.3 22.6,34.3 v22.8,34.5 | R11.P$1 22.6,33.3
  Bottom 0.2: v21.6,41.9 22.8,40.7 v22.8,34.5
TX_ACTIVE  (via drill 0.3)
  Top 0.2: IC2.20 2.3,16.9 v1.5,16.1 | R6.P$2 1.25,14.75 v1.5,14.5 | v4.8,9.1 4.75,9.15 U$2.6
  Bottom 0.2: 1.3,14.5 1.3,12 2.4,10.9 4.4,10.9 4.8,10.5 v4.8,9.1 | v1.5,16.1 1.3,15.9 1.3,14.5 | 1.3,14.5 v1.5,14.5
UART_RXD  (via drill 0.3)
  Top 0.1: IC5.N2 24.38,20.48 24.38,19.82 25.02,19.82 25.4,20.2
  Top 0.2: v28.8,23.4 28.8,21.2 27.8,20.2 25.4,20.2
  Bottom 0.2: v28.8,23.4 29.1,23.7 31.44,23.7 JP3.10
UART_TXD  (via drill 0.3)
  Top 0.1: IC5.N3 23.7,21.1 25.2,21.1
  Top 0.2: v28.8,24.2 28.7,24.2 28.2,23.7 28.2,22.2 27.9,21.9 26,21.9 25.2,21.1
  Bottom 0.2: v28.8,24.2 28.9,24.1 30.64,24.1 31.1,24.56 31.1,25.9 JP3.11
VBAT  (via drill 0.3, 0.5)
  Top 0.2: R21.P$1 11.75,40.9 IC16.2 IC16.3 | R15.P$2 v18,43.8
  Top 0.4: R21.P$1 v11.3,42.2 11.05,42.45 R20.P$2
  Bottom 0.2: 22.5,44.9 SJ3.2
  Bottom 0.4: JP4.6 25.57,47.87 24.3,46.6 | 24.3,46.6 23.1,46.6 | 23.1,46.6 22.67,46.17 SJ3.2 | 24.3,46.6 23.1,46.6
  Bottom 0.8: 22.5,44.9 19.1,44.9 v18,43.8 16.4,42.2 v11.3,42.2
VBAT_DIFF
  Top 0.1: IC5.P5 21.77,21.77 21.77,22.57 21.8,22.6
  Top 0.2: 21.8,22.6 21.8,35.5 21.5,35.8 19.1,35.8 18,36.9 R15.P$1 R16.P$2
VBAT_OUT  (via drill 0.3, 0.5)
  Top 0.2: IC16.4 11.3,39.9 R21.P$2 | 19.16,33.6 20.6,33.6 21.04,33.16 IC9.3 | C7.2 v29.5,25.85 | v30.4,24.7 30,24.3 30,20.2 30.5,19.7 30.5,10.3 v30.6,10.2 | C82.P$1 17.75,33.95 v18.1,33.6 19.16,33.6 | IC9.1 19.16,33.6 | IC14.1 27.96,9.06 28.3,9.4 v28.3,10.2 C80.P$1 | v16.2,10.6 16.16,10.64 IC8.1 14.36,10.64 14.15,10.85 C53.P$1
  Top 0.25: IC12.11 IC12.10
  Top 0.3: v25.8,25.3 IC10.5 | IC11.5 IC11.4 15.26,30.25 | IC12.10 13.5,30.25
  Top 0.4: v11.4,39.1 11.3,39.2 R21.P$2 | v25.8,25.3 27.4,25.3 27.95,25.85 C7.2
  Top 0.8: v18,30.65 17.6,30.25 15.26,30.25 13.5,30.25 C39.2 11.45,30.25 C37.2
  Bottom 0.2: v29.5,25.85 30.4,24.95 v30.4,24.7 | v30.6,10.2 v28.3,10.2 25.7,10.2 24.6,11.3 23.1,11.3 23,11.2 19.4,11.2 18.9,11.7 18.9,12.2 18.2,12.9 17,12.9 16.2,12.1 v16.2,10.6
  Bottom 0.4: v25.8,25.3 22.3,25.3 21.2,26.4 18.7,26.4 18.2,26.9 18.2,30.45 v18,30.65
  Bottom 0.8: v11.4,39.1 11.9,38.6 17,38.6 18.3,37.3 18.3,36.1 18.1,35.9 v18.1,33.6 18.1,30.75 v18,30.65
VCC  (via drill 0.3)
  Top 0.1: 8.35,4.8 C25.P$2 | 25,15.93 23.73,15.93 | 20.48,14.62 20.48,15.28 | 19.82,21.12 19.82,22.52
  Top 0.2: IC5.C9 IC5.C8 20.48,14.3 | 20.48,14.3 IC5.C7 IC5.C6 IC5.C5 | IC5.G13 IC5.H13 IC5.J13 IC5.J12 v18.2,17.55 | IC5.N10 IC5.N9 19.82,20.8 | v22.1,18.52 22.43,18.85 IC5.K4 | L16.1_6 L16.1_2 L16.1_4 L16.1_8 L16.1_1 L16.1_9 L16.1_5 L16.1_3 L16.1_7 | SJ2.3 v30,31.7 28.4,33.3 LED5.A 26.35,33.85 26.1,34.1 v23.6,34.1 | IC5.G3 IC5.F3 23.73,15.93 | v20.5,12.2 21.15,11.55 C35.P$1 C30.P$1 | IC5.C1 25.1,14.3 25.7,13.7 25.7,13.2 | IC5.P1 IC5.R1 25.1,22.5 C38.P$1 C36.P$1 26.05,24.5 | IC3.5 IC3.6 7.9,1.48 7.9,2.77 IC3.8 8.38,3.3 | IC5.N8 19.82,20.8 | 1.75,27.2 C11.P$2 1.75,28.15 2.65,29.05 L5.P$2 | 1.75,27.2 C10.P$2 1.75,26.2 | 1.75,27.2 IC1.6 | v14.2,17.5 14.15,17.55 C33.P$1 C29.P$1 11.45,17.55 v11.4,17.5 10.9,17 10.8,17 | 1.75,26.2 C9.P$2 1.75,25.45 v1.5,25.2 | 1.75,26.2 IC1.8 | 7.65,16.9 C20.P$2 7.65,17.45 7.2,17.9 IC2.8 | IC2.6 7.65,16.9 | 7.65,16.9 C18.P$2 7.65,15.65 7.9,15.4 8.9,15.4 9.3,15 R7.P$2 | R7.P$2 R8.P$2 9.65,12.95 | R7.P$2 9.65,15.45 10.8,16.6 10.8,17 | IC3.2 10.9,2.12 10.9,3.3 8.38,3.3 | 8.38,3.3 8.38,3.9 C25.P$2 | v20.15,15.6 20.48,15.28 | v21.6,39.75 IC4.6_V_BCKP 18.7,39.75 | 18.7,39.75 18.7,47.6 18.9,47.8 | R4.P$1 10.8,17 | 20.85,29.5 17.34,29.5 IC11.3 | 19.82,22.52 20,22.7 C32.P$1 20.45,23.45 20.8,23.8 v20.8,24.7 | 25.7,13.2 v25.7,12.2 | C34.P$1 25.7,13.2 | 8.35,4.8 10.7,7.15 10.7,11.9 9.65,12.95 | 18.6,38.65 18.6,39.65 18.7,39.75 | IC4.7_VCC_IO 18.6,38.65 | 18.6,38.65 R9.P$1 | C31.P$1 26,16.2 v25.8,16 25.73,15.93 25,15.93 | 20.48,14.3 20.48,14.62 | 19.82,20.8 19.82,21.12 | 9.65,12.95 C19.P$2 L8.P$2 7,12.95 C48.P$1 6.6,10.7 U$3.4 | JP4.1 20.49,47.8 18.9,47.8 | 18.9,47.8 18.65,48.05 C15.P$1
  Top 0.4: 29.5,20.4 29.5,24.9 | v28.8,20.4 29.5,20.4 | 29.85,17.5 LED6.A LED7.A LED8.A 29.85,12.25 v29.9,12.2 29.9,9.3 31,8.2 31,3.2 JP3.1 | v25.8,24.5 26.05,24.5 27.6,24.5 28,24.9 29.5,24.9 | C50.2 20.85,29.5 20.85,28.42 L16.1_8 | v20.8,24.7 20.5,25 20.5,26.3 20.59,26.39 L16.1_9 | 29.5,24.9 29.6,24.9 30.2,25.5 30.2,26.2 29.5,26.9 29.5,28.8 v29.4,28.9 | v6.4,23.7 6.5,23.6 7.5,23.6 8,23.1 v11.3,23.1 R1.P$1 12.1,23.7 12.2,23.8 12.7,23.8 13.1,24.2 v13.1,24.5 | 29.5,20.4 29.5,19.9 29.85,19.55 LED9.A 29.85,17.5 | 29.85,17.5 v29.9,17.5
  Bottom 0.2: U$1.4 22.1,24.7 | v23.6,34.1 23.4,33.9 22.5,33.9 22.2,34.2 22.2,35 22.4,35.2 22.4,38.95 v21.6,39.75
  Bottom 0.4: v30,31.7 29.4,31.1 v29.4,28.9 | v29.9,12.2 v25.7,12.2 v20.5,12.2 20.15,12.55 v20.15,15.6 | v20.8,24.7 20.7,24.7 | v20.8,24.7 22.1,24.7 25.4,24.7 25.6,24.5 v25.8,24.5 | v1.5,25.2 2.6,25.2 3.6,24.2 5.9,24.2 v6.4,23.7 | v11.3,23.1 11.4,23 v11.4,17.5 | v14.2,17.5 14.25,17.55 v18.2,17.55 | v13.1,24.5 14,25.4 15.2,25.4 15.6,25 17.3,25 17.6,25.3 20.2,25.3 v20.8,24.7 | v25.8,16 26.1,16 27.6,17.5 v29.9,17.5 | v28.8,20.4 28.4,20 24.6,20 23.12,18.52 v22.1,18.52
VCC2V7
  Top 0.2: IC16.10 16.9,41.4 17.6,40.7 17.6,36.7 17.75,36.55 C81.P$1 18.4,35.9 19.16,35.14 IC9.5
VCC3V3  (via drill 0.3)
  Top 0.2: L14.1_7 L14.1_3 L14.1_5 L14.1_9 L14.1_1 L14.1_8 L14.1_4 L14.1_2 | L14.1_6 L14.1_2 | R17.P$2 C56.P$2 23.15,28.75 23,28.9 23,30.8 23.5,31.3 L14.1_2 | SJ1.1 SJ2.1 v30,33.3 | 27.8,31.49 27.3,31.49 v27.3,32.7
  Top 0.4: C49.2 27.8,31.49 L14.1_9
  Bottom 0.2: v30,33.3 28.8,32.1 27.8,32.1 27.3,32.6 v27.3,32.7
VCC_PA  (via drill 0.3)
  Top 0.2: IC13.1 IC13.2 IC13.3 | R38.P$2 2.3,32.3 3.15,33.15 C62.2 | L11.P$2 9.7,39.3 C68.P$2 C69.P$2 | 13.5,36.2 14,36.2 14.7,36.9 R12.P$2 | C79.P$2 9.75,35.9 v9.95,36.1
  Top 0.25: IC13.22 2.65,37.45 2.4,37.2 2.4,36.1 | 2.4,36.1 C65.P$2 | v3,35.6 3.24,35.84 IC13.1 | 2.4,36.1 2.9,35.6 v3,35.6 | v3,35.6 2.95,35.55 C61.P$2 2.95,33.15 C62.2 | IC12.4 IC12.5 13.5,36.2
  Top 0.4: v9.95,36.1 C72.2 | C72.2 C73.2 11.65,36.2 13.5,36.2 | 9.7,39.3 9.7,37.4 C72.2
  Bottom 0.4: v3,35.6 3.5,36.1 v9.95,36.1
VSOLAR  (via drill 0.3)
  Top 0.2: L13.1_6 L13.1_2 L13.1_4 | L13.1_7 L13.1_3 L13.1_5 L13.1_9 L13.1_1 L13.1_8 L13.1_4 | L13.1_4 8,43.8 | C46.2 11.35,48.3 10.05,48.3 R23.P$2
  Top 0.3: IC7.1 8.68,46.88 7.81,46.01 L13.1_9 | C46.2 11.38,48.6 IC7.1 | IC7.8 15.93,46.88 v15.9,46.9 | v12.7,46.9 12.68,46.88 IC7.1
  Bottom 0.3: 15.2,49.1 JP2.P$1 | 15.9,48.6 15.7,48.6 JP2.P$1 | JP2.P$1 14.4,48.6
  Bottom 0.6: v15.9,46.9 15.9,48.6 | 14.4,48.6 v12.7,46.9
  Bottom 0.8: JP4.2 20.49,49.3 15.7,49.3 15.7,48.6
VSOLAR_DIFF  (via drill 0.3)
  Top 0.1: 21.4,22.8 21.12,22.52 21.12,21.12 21.77,21.12 IC5.N5
  Top 0.2: v10.2,47.7 R25.P$2 9.45,47.85 8.55,48.75 R23.P$1 | v9.9,42.6 10.5,42 v10.5,39.1 | v21.2,25.4 21.4,25.2 21.4,22.8
  Bottom 0.2: v10.2,47.7 10.2,43.7 9.9,43.4 v9.9,42.6 | v10.5,39.1 10.5,39 11.6,37.9 16.7,37.9 17.6,37 17.6,36.4 17.4,36.2 17.4,31.4 17.3,31.3 17.3,30.3 17.7,29.9 17.7,26.6 18.5,25.8 20.8,25.8 v21.2,25.4
(copper drawn outside any net)
  shapes: Bottom area x1, Top area x2

## Text on the board
tTest: Pecan Pico 7b | OVER THE / HILLS
bTest: RADIO1 | VCC SOLAR | SWITCH ON | GPS ANTENNA | I2C Header / 1 VCC GND SCL SDA / VSOL GND BAT1 BAT2 8 | GND | GND | GND | TXD | RXD | GND | LEDs | BOOT0 | March 2016 | SWD INTERFACE | 1 | RADIO2